# EAGLE design LCDi2c (EAGLE 5.11)
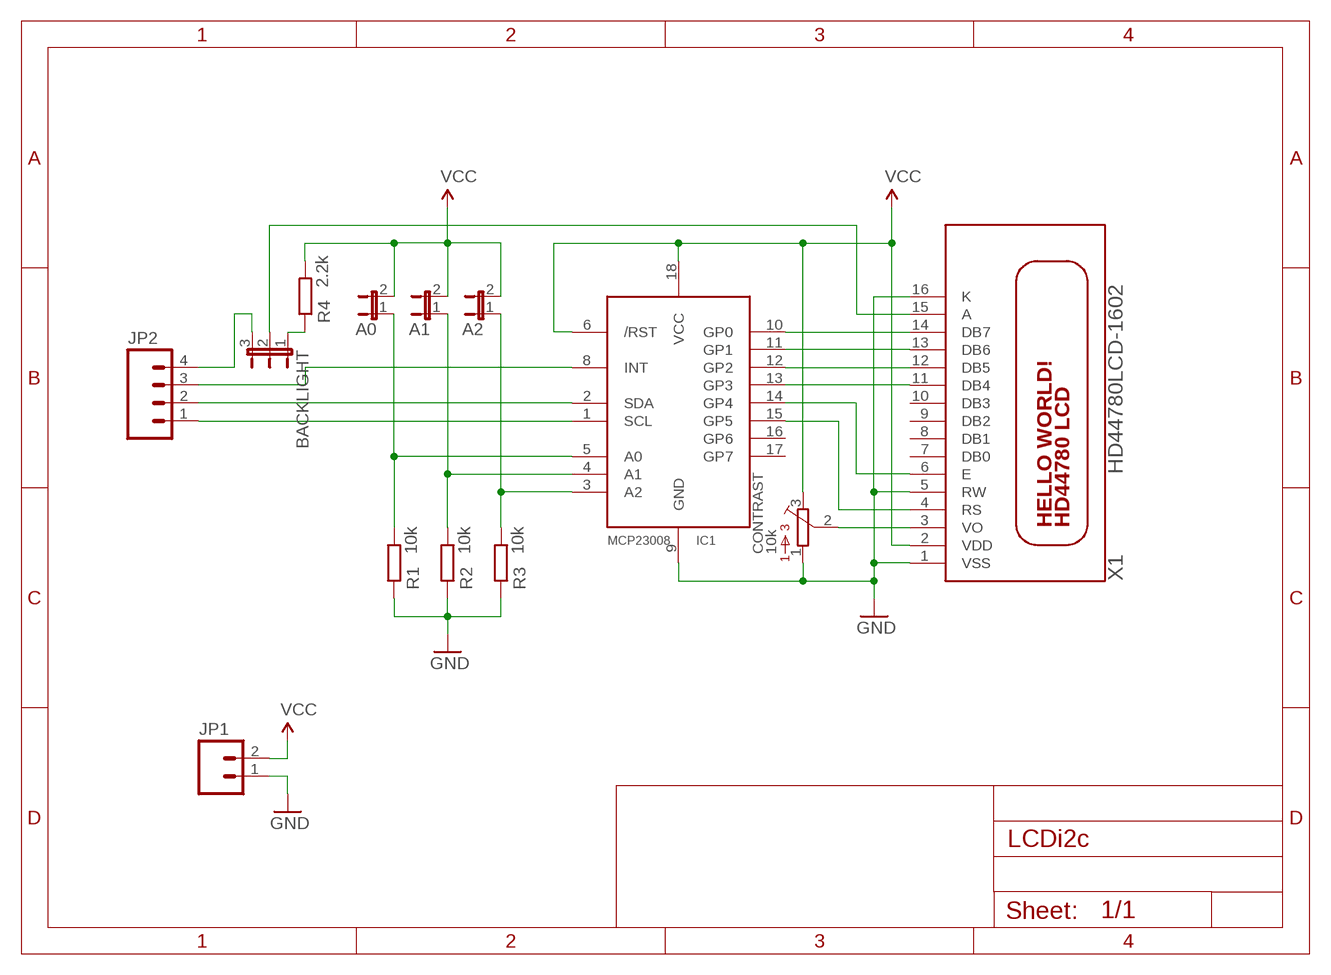
[diagram p0: schematic, sheet 1]

## Parts
A0  JP1E  [JP1]
A1  JP1E  [JP1]
A2  JP1E  [JP1]
BACKLIGHT  JP2E  [JP2]
CONTRAST  10k  3386-T  [3386T]
IC1  MCP23008/P  [DIL18]
JP1  HEADER_1X02PTH  [1X02]
JP2  HEADER_1X04PTH  [1X04]
R1  10k  R-EU_0207/10  [0207/10]
R2  10k  R-EU_0207/10  [0207/10]
R3  10k  R-EU_0207/10  [0207/10]
R4  2.2k  R-EU_0207/10  [0207/10]
X1  HD44780LCD-1602  [LCD1602]

## Nets
BL: BACKLIGHT.3 JP2.4
GND [GND]: JP1.1 R1.1 R2.1 R3.1
INT: IC1.8(INT) JP2.3
N$1: IC1.10(GP0) X1.14(DB7)
N$2: IC1.11(GP1) X1.13(DB6)
N$3: IC1.12(GP2) X1.12(DB5)
N$4: IC1.13(GP3) X1.11(DB4)
N$5: IC1.14(GP4) X1.6(E)
N$6: IC1.15(GP5) X1.4(RS)
N$7: A0.1 IC1.5(A0) R1.2
N$8: A1.1 IC1.4(A1) R2.2
N$9: A2.1 IC1.3(A2) R3.2
N$13: BACKLIGHT.2 X1.15(A)
N$14: BACKLIGHT.1 R4.1
N$15: CONTRAST.2 X1.3(VO)
SCL: IC1.1(SCL) JP2.1
SDA: IC1.2(SDA) JP2.2
VCC [VCC]: A0.2 A1.2 A2.2 CONTRAST.3 IC1.6(/RST) IC1.18(VCC) JP1.2 R4.2 X1.2(VDD)
VSS: CONTRAST.1 IC1.9(GND) X1.1(VSS) X1.5(RW) X1.16(K) ; supply symbol labelled GND
Unconnected: IC1.16(GP6) IC1.17(GP7) X1.7(DB0) X1.8(DB1) X1.9(DB2) X1.10(DB3)

## Library data of the parts
A0 A1 A2 = MyLibrary:JP1E: JUMPER
BACKLIGHT = MyLibrary:JP2E: JUMPER
CONTRAST = MyLibrary:3386-: 3386 Series 3/8" Square Trimmer
IC1 = MyLibrary:MCP23008: MCP23008 Inexpensive i2c i/o expander - 8 general purpose i/o pins with optional pullups
JP1 = MyLibrary:HEADER_1X02: Header 2 Standard 2-pin 0.1" header. Use with straight break away headers (SKU : PRT-00116), right angle break away headers (PRT-00553), swiss pins (PRT-00743), machine pins (PRT-00117), and female headers (PRT-00115). Molex polarized connector foot print use with SKU : PRT-08233 with associated crimp pins and housings.
JP2 = MyLibrary:HEADER_1X04: Header 4 Standard 4-pin 0.1" header. Use with straight break away headers (SKU : PRT-00116), right angle break away headers (PRT-00553), swiss pins (PRT-00743), machine pins (PRT-00117), and female headers (PRT-00115). Molex polarized connector foot print use with SKU : PRT-08231 with associated crimp pins and housings. 1MM SMD Version SKU: PRT-10208
R1-R4 = MyLibrary:R-EU_: RESISTOR, European symbol
X1 = MyLibrary:HD44780LCD: HD44780 LCD Standard character type LCDs, available in sizes from 8x1 to 40x4!

## Net classes
0 default: width 0.635 mm, drill 0.7 mm, clearance 0.254 mm
1 VCC: width 0.635 mm, drill 0.7 mm, clearance 0.254 mm to class 0, clearance 0.254 mm
2 GND: width 0.635 mm, drill 0.7 mm, clearance 0.254 mm to class 0, clearance 0.254 mm to class 1, clearance 0.254 mm
3 border: width 0.254 mm, clearance 0.254 mm to class 0, clearance 0.254 mm to class 1, clearance 0.254 mm to class 2, clearance 0.254 mm

## Board
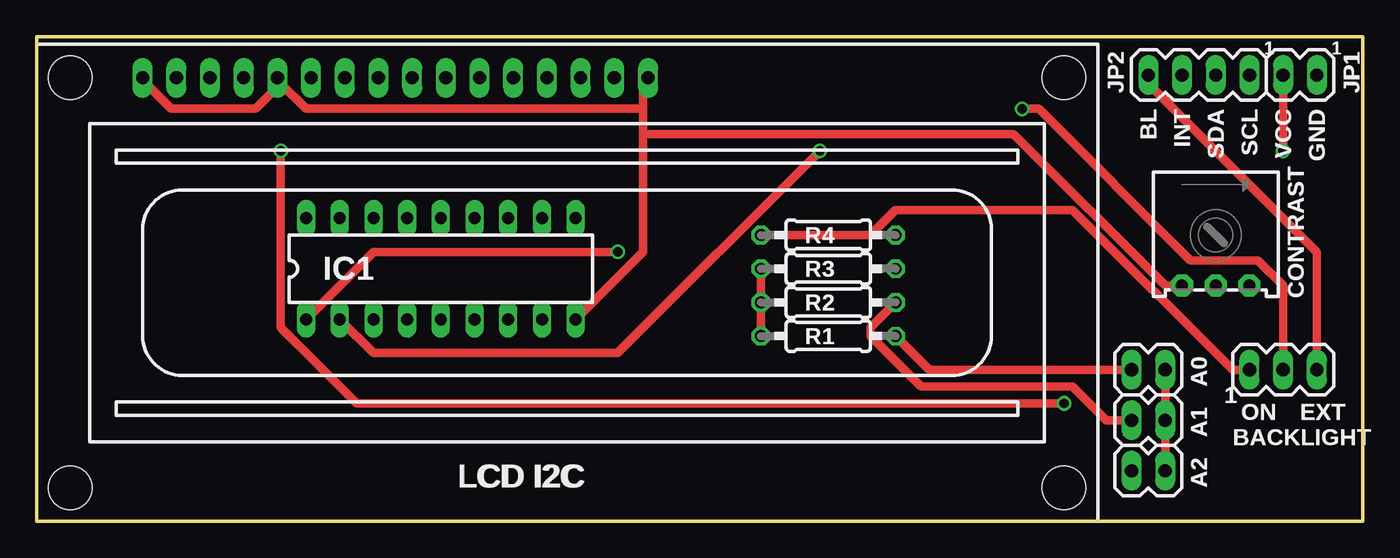
[diagram p1: board, top side]
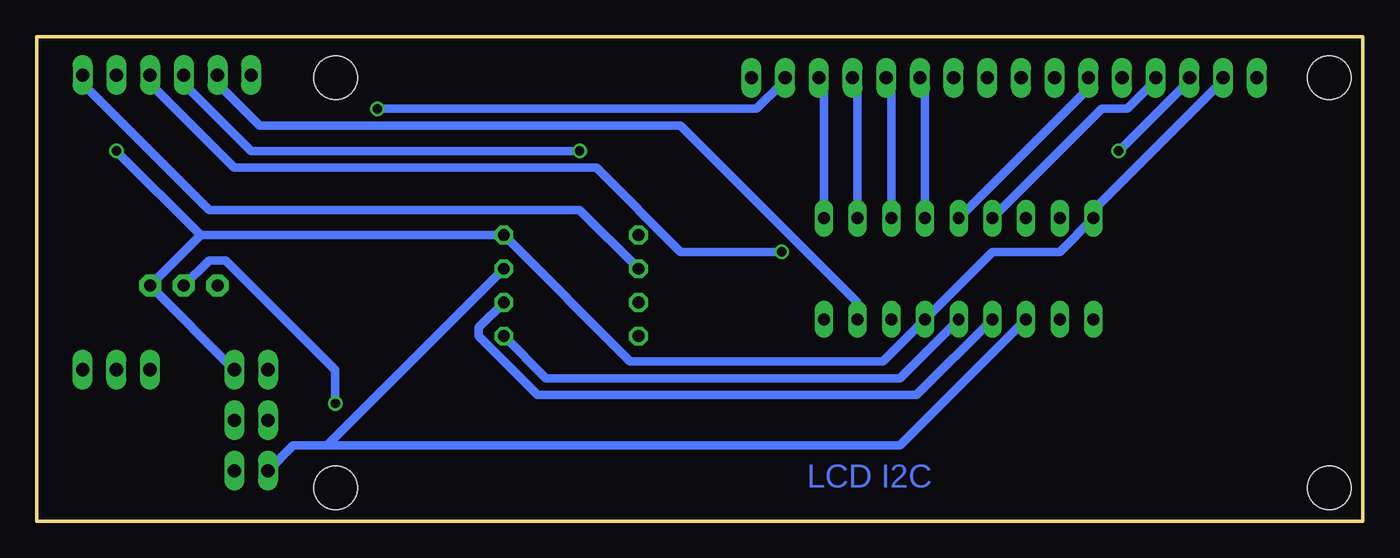
[diagram p2: board, bottom side, seen from below]

Size 100 x 36.57 mm. Coordinates in mm from the lower left corner, seen from the top.
Outline: 0,0 100,0 100,36.57 0,36.57 0,0
Copper layers (1*16): Top 0.035mm / dielectric 1.5mm / Bottom 0.035mm
Design rules "default *": minimum track width 10mil, minimum drill 0.7mm, track to track 8mil, track to pad 8mil, pad to pad 8mil, via to via 8mil, smd to smd 8mil, copper to edge 40mil, drill to drill 8mil, minimum pad ring 10mil, minimum via ring 8mil, stop-mask expansion 4mil, vias tented up to drill 0mil, thermal gap 10mil

### Footprints (pad centres in the part's own frame; a part is rotated, then mirrored left to right if it is on the bottom)
JP1 = drill 1 long: 1 0,-1.27; 2 0,1.27
JP2 = drill 1 long: 1 -2.54,0; 2 0,0; 3 2.54,0
3386T = drill 0.9 pad 1.676 octagon: 1 -2.54,-3.81; 2 0,-3.81; 3 2.54,-3.81
DIL18 = drill 0.9 long: 1 -10.16,-3.81; 2 -7.62,-3.81; 3 -5.08,-3.81; 4 -2.54,-3.81; 5 0,-3.81; 6 2.54,-3.81; 7 5.08,-3.81; 8 7.62,-3.81; 9 10.16,-3.81; 10 10.16,3.81; 11 7.62,3.81; 12 5.08,3.81; 13 2.54,3.81; 14 0,3.81; 15 -2.54,3.81; 16 -5.08,3.81; 17 -7.62,3.81; 18 -10.16,3.81
1X02 = drill 1 long: 1 0,0; 2 2.54,0
1X04 = drill 1 long: 1 0,0; 2 2.54,0; 3 5.08,0; 4 7.62,0
0207/10 = drill 0.9 octagon: 1 -5.08,0; 2 5.08,0
LCD1602 = drill 1 long: 1 8,33.46; 2 10.54,33.46; 3 13.08,33.46; 4 15.62,33.46; 5 18.16,33.46; 6 20.7,33.46; 7 23.24,33.46; 8 25.78,33.46; 9 28.32,33.46; 10 30.86,33.46; 11 33.4,33.46; 12 35.94,33.46; 13 38.48,33.46; 14 41.02,33.46; 15 43.56,33.46; 16 46.1,33.46 | hole 3.3: 2.54,2.54; 2.54,33.46; 77.46,33.46; 77.46,2.54

### Placement (x,y rotation side)
A0  83.82,11.43 270 top
A1  83.82,7.62 270 top
A2  83.82,3.81 270 top
BACKLIGHT  93.98,11.43 0 top
CONTRAST  88.9,21.59 0 top
IC1  30.48,19.05 0 top
JP1  96.52,33.66 180 top
JP2  91.44,33.66 180 top
R1  59.69,13.97 0 top
R2  59.69,16.51 0 top
R3  59.69,19.05 0 top
R4  59.69,21.59 0 top
X1  0,0 0 top

### Tracks (layer width: path | path; a pad name or v marks a point on that pad's centre or on a via)
BL
  Top 0.635: BACKLIGHT.3 96.52,20.32 83.82,33.02 JP2.4
GND
  Top 0.635: R1.1 R2.1 R3.1
  Bottom 0.635: JP1.1 96.52,33.02 87,23.5 59.05,23.5 R3.1
INT
  Bottom 0.635: IC1.8 38.1,16.51 51.44,29.84 83.19,29.84 86.36,33.02 JP2.3
N$1
  Bottom 0.635: IC1.10 40.64,33.02 X1.14
N$2
  Bottom 0.635: IC1.11 38.1,33.02 X1.13
N$3
  Bottom 0.635: IC1.12 35.56,33.02 X1.12
N$4
  Bottom 0.635: IC1.13 33.02,33.02 X1.11
N$5
  Bottom 0.635: IC1.14 20.32,33.02 X1.6
N$6
  Bottom 0.635: IC1.15 19.68,31.11 17.78,31.11 15.88,33.02 X1.4
N$7
  Top 0.635: A0.1 67.31,11.43 R1.2
  Bottom 0.635: IC1.5 34.92,10.79 61.59,10.79 R1.2
N$8
  Top 0.635: A1.1 80.64,7.62 78.11,10.16 66.67,10.16 62.87,13.97 62.87,14.61 R2.2
  Bottom 0.635: IC1.4 33.66,9.53 62.23,9.53 66.67,13.97 66.67,14.61 R2.2
N$9
  Bottom 0.635: IC1.3 34.92,5.71 78.11,5.71 | 78.11,5.71 80.64,5.71 A2.1 | 78.11,5.71 R3.2
N$13  (via drill 0.7)
  Top 0.635: v74.3,31.11 75.56,31.11 87,19.68 92.08,19.68 93.98,17.78 BACKLIGHT.2
  Bottom 0.635: v74.3,31.11 45.72,31.11 43.81,33.02 X1.15
N$14
  Top 0.635: R4.1 62.87,21.59 64.77,23.5 78.11,23.5 90.17,11.43 BACKLIGHT.1
N$15  (via drill 0.7)
  Top 0.635: v18.41,27.94 18.41,14.61 24.13,8.89 v77.47,8.89
  Bottom 0.635: v18.41,27.94 13.34,33.02 X1.3 | v77.47,8.89 77.47,11.43 85.72,19.68 87,19.68 CONTRAST.2
N$16
  Top 0.254: 0,0 0,36.57 | 0,36.57 100,36.57 100,0 0,0 | 0,0 0,36.57
N$18
  Bottom 0.254: 0,0 0,36.57 100,36.57 100,0 0,0
SCL  (via drill 0.7)
  Top 0.635: IC1.1 25.4,20.32 v43.81,20.32
  Bottom 0.635: v43.81,20.32 51.44,20.32 57.78,26.67 85.09,26.67 91.44,33.02 JP2.1
SDA  (via drill 0.7)
  Top 0.635: IC1.2 25.4,12.7 43.81,12.7 v59.05,27.94
  Bottom 0.635: v59.05,27.94 83.82,27.94 88.9,33.02 JP2.2
VCC  (via drill 0.7)
  Top 0.635: A2.2 A1.2 A0.2 | v93.98,27.94 JP1.2
  Bottom 0.635: X1.2 10.79,33.02 20.32,23.5 IC1.18 22.86,20.32 27.94,20.32 IC1.6 36.2,12.06 55.24,12.06 R4.2 87.63,21.59 | 87.63,21.59 CONTRAST.3 A0.2 | 87.63,21.59 v93.98,27.94
VSS
  Top 0.635: 18.41,33.02 16.51,31.11 10.16,31.11 8.26,33.02 X1.1 | IC1.9 45.72,20.32 45.72,29.21 | 45.72,31.11 45.72,33.02 X1.16 | 45.72,31.11 45.72,29.21 | CONTRAST.1 85.09,17.78 73.66,29.21 45.72,29.21 | 18.41,33.02 20.32,31.11 45.72,31.11 | 18.41,33.02 X1.5

### Text on the board
Top: LCD I2C
Bottom: LCD I2C
tNames: BL | INT | SDA | SCL | VCC | GND | ON | EXT | LCD I2C
_tsilk: 1 | 1 | JP2 | JP1 | BL | INT | SDA | SCL | VCC | GND | R4 | IC1 | R3 | CONTRAST | R2 | R1 | A0 | 1 | ON | EXT | A1 | BACKLIGHT | LCD I2C | A2
Contour: LCD I2C